# EAGLE design fonte (EAGLE 9.6.2)
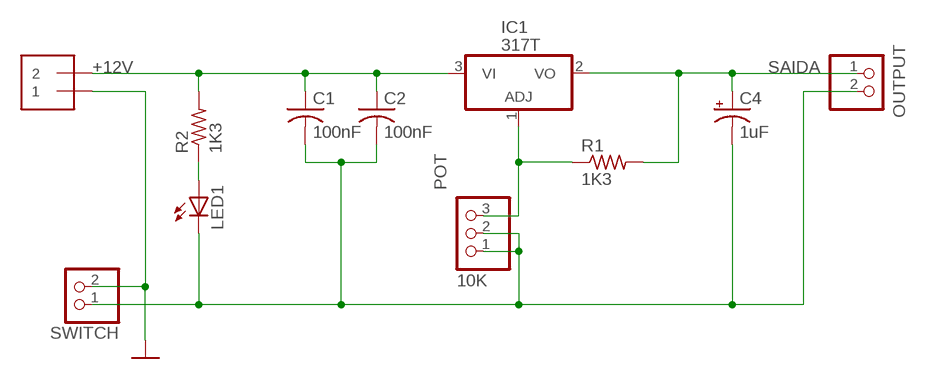
[diagram p0: schematic, sheet 1]

## Parts
C1  100nF  C-US025-025X050  [C025-025X050]
C2  100nF  C-US025-025X050  [C025-025X050]
C4  1uF  10UF-POLAR-RADIAL-2.5MM-25V-20%  [CPOL-RADIAL-2.5MM-5MM]
IC1  317T  [TO220H]
INPUT  1X2-3.5MM  [1X2-3.5MM]
LED1  LED5MM  [LED5MM]
OUTPUT  PINHD-1X2  [1X02]
POT  10K  PINHD-1X3  [1X03]
R1  1K3  R-US_0204/7  [0204/7]
R2  1K3  R-US_0204/7  [0204/7]
SWITCH  PINHD-1X2  [1X02]

## Nets
+12V: C1.1 C2.1 IC1.3(VI) INPUT.2 R2.2
GND: INPUT.1 SWITCH.2
N$1: IC1.1(ADJ) POT.3 R1.1
N$2: LED1.A R2.1
N$6: C1.2 C2.2 C4.2(-) LED1.K(C) OUTPUT.2 POT.1 POT.2 SWITCH.1
SAIDA: C4.1(+) IC1.2(VO) OUTPUT.1 R1.2

## Library data of the parts
C1 C2 = adafruit:C-US: CAPACITOR, American symbol
C4 = SparkFun-Capacitors:10UF-POLAR: 10.0µF polarized capacitors A capacitor is a passive two-terminal electrical component used to store electrical energy temporarily in an electric field.; PROD_ID: CAP-08440; VALUE: 10uF
IC1 = linear:*317: Positive VOLTAGE REGULATOR
INPUT = adafruit:1X2: 3.5mm Terminal block http://www.ladyada.net/library/pcb/eaglelibrary.html
LED1 = adafruit:LED: LED OSRAM: - CHIPLED LG R971, LG N971, LY N971, LG Q971, LY Q971, LO R971, LY R971 LH N974, LH R974 LS Q976, LO Q976, LY Q976 LO Q996 - Hyper CHIPLED LW Q18S LB Q993, LB Q99A, LB R99A - SideLED LS A670, LO A670, LY A670, LG A670, LP A670 LB A673, LV A673, LT A673, LW A673 LH A674 LY A675 LS A676, LA A676, LO A676, LY A676, LW A676 LS A679, LY A679, LG A679 - Hyper Micro SIDELED® LS Y876, LA Y876, LO Y876, LY Y876 LT Y87S - SmartLED LW L88C, LW L88S LB L89C, LB L89S, LG L890 LS L89K, LO L89K, LY L89K LS L896, LA L896, LO L896, LY L896 - TOPLED LS T670, LO T670, LY T670, LG T670, LP T670 LSG T670, LSP T670, LSY T670, LOP T670, LYG T670 LG T671, LOG T671, LSG T671 LB T673, LV T673, LT T673, LW T673 LH T674 LS T676, LA T676, LO T676, LY T676, LB T676, LH T676, LSB T676, LW T676 LB T67C, LV T67C, LT T67C, LS T67K, LO T67K, LY T67K, LW E67C LS E67B, LA E67B, LO E67B, LY E67B, LB E67C, LV E67C, LT E67C LW T67C LS T679, LY T679, LG T679 LS T770, LO T770, LY T770, LG T770, LP T770 LB T773, LV T773, LT T773, LW T773 LH T774 LS E675, LA E675, LY E675, LS T675 LS T776, LA T776, LO T776, LY T776, LB T776 LHGB T686 LT T68C, LB T68C - Hyper Mini TOPLED® LB M676 - Mini TOPLED Santana® LG M470 LS M47K, LO M47K, LY M47K Source: http://www.osram.convergy.de/
OUTPUT SWITCH = Connector:PINHD-1X2: PIN HEADER; CATEGORY: CONNECTOR; SUB-CATEGORY: PIN-HEADER
POT = adafruit:PINHD-1X3: PIN HEADER
R1 R2 = adafruit:R-US_: RESISTOR, American symbol

## Board
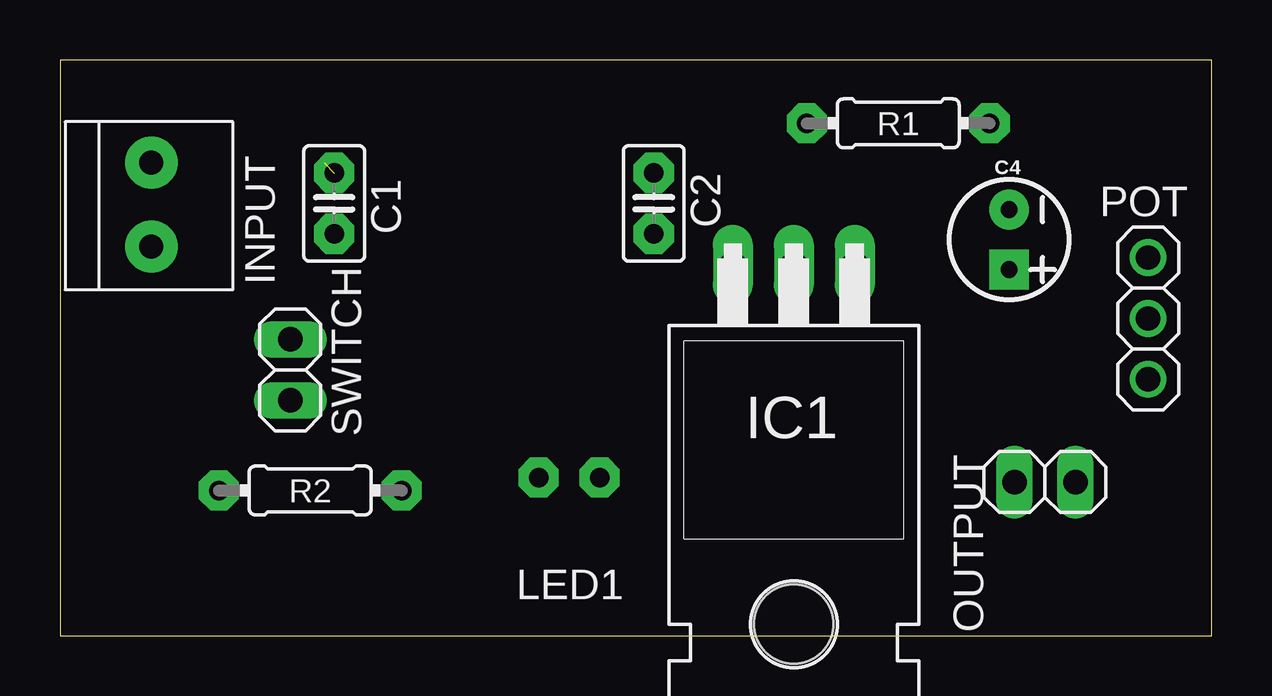
[diagram p1: board, top side]
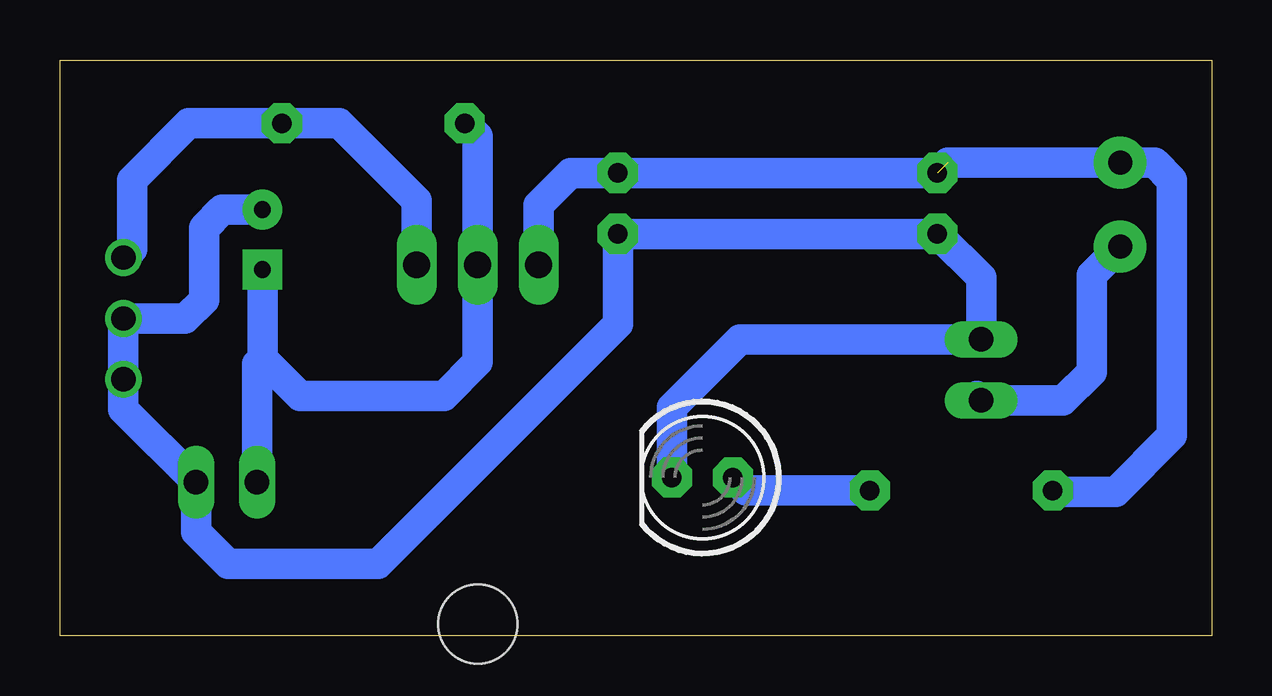
[diagram p2: board, bottom side, seen from below]

Size 48 x 24 mm. Coordinates in mm from the lower left corner, seen from the top.
Outline: 0,0 48,0 48,24 0,24 0,0
Copper layers (1*16): Top 0.035mm / dielectric 1.5mm / Bottom 0.035mm
Design rules "default": minimum track width 6mil, minimum drill 0.35mm, track to track 6mil, track to pad 6mil, pad to pad 6mil, via to via 6mil, smd to smd 6mil, copper to edge 40mil, drill to drill 6mil, minimum pad ring 10mil, minimum via ring 8mil, stop-mask expansion 4mil, vias tented up to drill 0mil, thermal gap 10mil

### Footprints (pad centres in the part's own frame; a part is rotated, then mirrored left to right if it is on the bottom)
C025-025X050 = drill 0.813 pad 1.676 octagon: 1 -1.27,0; 2 1.27,0
CPOL-RADIAL-2.5MM-5MM = drill 0.7 pad 1.651 square: 1 1.25,0 | drill 0.7 pad 1.651: 2 -1.25,0
TO220H = drill 1.118 long: 1 -2.54,-10.16; 2 0,-10.16; 3 2.54,-10.16 | hole 3.302: 0,4.826
1X2-3.5MM = drill 1 pad 2.184: 1 1.8,0; 2 -1.7,0
LED5MM = drill 0.813 pad 1.676 octagon: A -1.27,0; K 1.27,0
1X02 = drill 1.016 long: 1 -1.27,0; 2 1.27,0
1X03 = drill 1.016: 1 -2.54,0; 2 0,0; 3 2.54,0
0204/7 = drill 0.813 pad 1.676 octagon: 1 -3.81,0; 2 3.81,0

### Placement (x,y rotation side)
C1  11.43,18.02 270 top
C2  24.75,18.02 270 top
C4  39.56,16.51 270 top
IC1  30.59,5.3 180 top
INPUT  3.81,18.02 270 top
LED1  21.22,6.59 180 bottom
OUTPUT  41.06,6.4 0 top
POT  45.36,13.22 90 top
R1  34.94,21.36 180 top
R2  10.43,6.05 180 top
SWITCH  9.6,11.08 270 top

### Tracks (layer width: path | path; a pad name or v marks a point on that pad's centre or on a via)
+12V  (1 unrouted)
  Bottom 1.27: 11,19.72 INPUT.2 2.37,19.72 1.65,19 1.65,8.35 4,6 6.57,6 R2.2 | IC1.3 28.05,17.95 26.71,19.29 C2.1 C1.1
GND
  Bottom 1.27: INPUT.1 5,15.03 5,11 6.19,9.81 SWITCH.2 9.79,10
N$1
  Bottom 1.27: IC1.1 33.13,18.13 36.36,21.36 R1.1 42.64,21.36 45,19 45,16.12 POT.3
N$2
  Bottom 1.27: LED1.A 19.41,6.05 R2.1
N$6
  Bottom 1.27: LED1.K 22.49,9.51 19.65,12.35 SWITCH.1 9.6,14.92 C1.2 C2.2 24.75,12.98 34.73,3 41,3 42.33,4.33 OUTPUT.2 45.36,9.43 POT.1 POT.2 42.78,13.22 42,14 42,17 41.24,17.76 C4.2
SAIDA
  Bottom 1.27: C4.1 39.56,11.56 | 39.56,11.56 38,10 32,10 30.59,11.41 IC1.2 30.59,20.82 R1.2 | 39.56,11.56 39.79,11.33 OUTPUT.1